# Altium schematic sheet Mosfet Driver.SchDoc
size A4
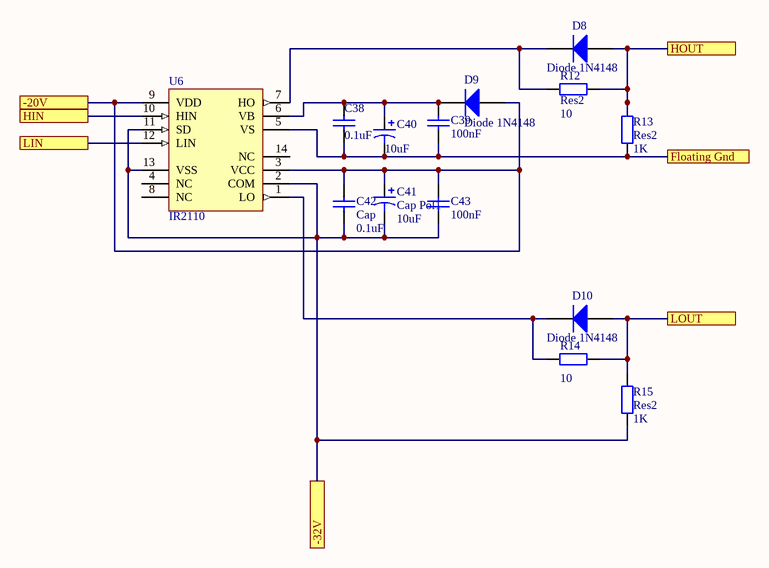
[diagram p0: Mosfet Driver.SchDoc]

## Parts
C38  value 0.1uF  [CAP DISCO 200mil]  (hidden comment: Cap)
C39  VALOR: 100nF  [RAD-0.3]  (hidden comment: Cap Ceramico Disco)
C40  value 10uF  [CAPR D250 H450 R100 mil]  (hidden comment: Cap Pol1)
C41  Cap Pol1  value 10uF  [CAPR D250 H450 R100 mil]
C42  Cap  value 0.1uF  [CAP DISCO 200mil]
C43  VALOR: 100nF  [RAD-0.3]  (hidden comment: Cap Ceramico Disco)
D8  Diode 1N4148  [SOD323-F]
D9  Diode 1N4148  [SOD323-F]
D10  Diode 1N4148  [SOD323-F]
R12  Res2  value 10  [1206 resistor]
R13  Res2  value 1K  [1206 resistor]
R14  value 10  [1206 resistor]  (hidden comment: Res2)
R15  Res2  value 1K  [1206 resistor]
U6  IR2110  [PDIP14]

## Ports
-20V, -32V, Floating Gnd, HIN, HOUT, LIN, LOUT

## Nets
-20V: C41.1 C42.2 C43.2 D9.1(A) U6.3(VCC) U6.9(VDD) ; port -20V
-32V: C41.2 C42.1 C43.1 R15.2 U6.2(COM) U6.11(SD) U6.13(VSS) ; port -32V
Floating Gnd: C38.1 C39.1 C40.2 R13.1 U6.5(VS) ; port Floating Gnd
HIN: U6.10(HIN) ; port HIN
HOUT: D8.1(A) R12.2 R13.2 ; port HOUT
LIN: U6.12(LIN) ; port LIN
LOUT: D10.1(A) R14.1 R15.1 ; port LOUT
NetC38_2: C38.2 C39.2 C40.1 D9.2(K) U6.6(VB)
NetD8_2: D8.2(K) R12.1 U6.7(HO)
NetD10_2: D10.2(K) R14.2 U6.1(LO)

Not connected (* = marked no-connect by the designer): U6 4(NC) 8(NC) 14(NC)

## Library data of the parts
C38 C42 = Cap: Capacitor; Published: 8-Jun-2000; LatestRevisionDate: 17-Jul-2002; LatestRevisionNote: Re-released for DXP Platform.; PackageReference: RAD-0.3; Publisher: Altium Limited; PackageDescription: Radial Cap, Thru-Hole; 2 Leads; 0.3 in Pin Spacing
C39 C43 = Cap Ceramico Disco: Capacitor Ceramico de Insercion; FABRICANTE: Generico; CODIGO STI: *; PROVEEDOR: *
C40 C41 = Cap Pol1: Polarized Capacitor (Radial); Published: 8-Jun-2000; LatestRevisionDate: 17-Jul-2002; LatestRevisionNote: Re-released for DXP Platform.; PackageReference: RB7.6-15; Publisher: Altium Limited; PackageDescription: Polarized Capacitor (Radial); 2 Leads
D8-D10 = Diode 1N4148: High Conductance Fast Diode; Published: 8-Jun-2000; LatestRevisionDate: 17-Jul-2002; LatestRevisionNote: Re-released for DXP Platform.; DatasheetVersion: 1997; PackageReference: DO-35; Publisher: Altium Limited; PackageDescription: Diode, Axial; Body 3.8 x 1.9 mm (LxDia. max), Lead Dia. 0.53 mm (max); Code_JEDEC: DO-204-AH; ComponentLink1Description: Manufacturer Link; ComponentLink1URL: http://www.fairchildsemi.com/; ComponentLink2Description: Datasheet; ComponentLink2URL: http://www.fairchildsemi.com/ds/1N%2F1N4148.pdf
R12-R15 = Res2: Resistor; Published: 8-Jun-2000; LatestRevisionDate: 17-Jul-2002; LatestRevisionNote: Re-released for DXP Platform.; PackageReference: AXIAL-0.4; Publisher: Altium Limited; PackageDescription: Axial Device, Thru-Hole; 2 Leads; 0.4 in Pin Spacing
U6 = IR2110: High and Low Side Driver; Note: Pins 4, 8 and 14 are not connected; Published: 8-Jun-2000; LatestRevisionDate: 04-Mar-2005; LatestRevisionNote: Stylized 3D Model Added.; DatasheetVersion: PD60147J; PackageReference: PDIP14; Publisher: Altium Limited; PackageDescription: DIP; 14 Leads; Row Spacing 7.62 mm; Pitch 2.54 mm; ComponentLink1Description: Manufacturer Link; ComponentLink1URL: http://www.irf.com/; ComponentLink2Description: Datasheet; ComponentLink2URL: http://www.irf.com/product-info/datasheets/data/ir2110.pdf